# Altium schematic sheet Sheet_1_2021-12-20.schdoc
size 50 x 40 mm
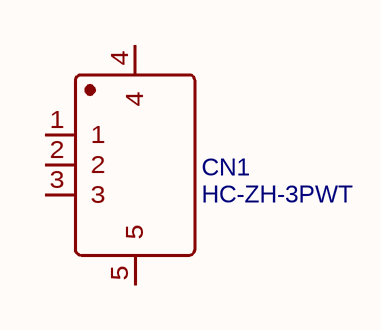
[diagram p0: Sheet_1_2021-12-20.schdoc]

## Parts
CN1  HC-ZH-3PWT  [CONN-SMD_HC-ZH-3PWT]

## Nets

Not connected (* = marked no-connect by the designer): CN1 1 2 3 4 5

## Library data of the parts
CN1 = HC-ZH-3PWT: BOM_Manufacturer: HCTL(华灿天禄); Contributor: LCSC; BOM_Supplier: LCSC; BOM_Supplier Part: C2845425; BOM_Manufacturer Part: HC-ZH-3PWT; spicePre: C; spiceSymbolName: HC-ZH-3PWT